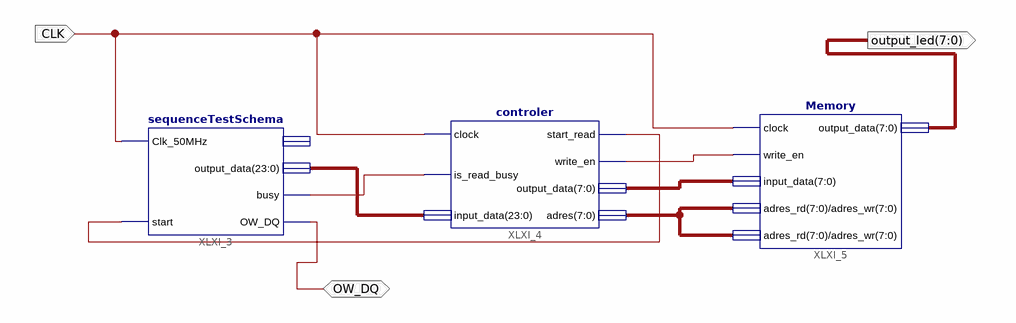
[diagram p0: schematic sheet 1]
// Xilinx ISE schematic seq_controler.sch (spartan3e) as structural Verilog: 3 symbols, 3 ports
module seq_controler (
  input  CLK,
  inout  OW_DQ,
  output [7:0] output_led
);

  wire clkout, XLXN_1, XLXN_7;
  wire [7:0] XLXN_11, XLXN_13;
  wire [23:0] XLXN_2;

  sequenceTestSchema XLXI_3 (
    .Clk_50MHz(CLK), .start(XLXN_7), .output_data(XLXN_2), .busy(XLXN_1), .OW_DQ(OW_DQ));  // open: test_out
  controler XLXI_4 (
    .clock(CLK), .is_read_busy(XLXN_1), .input_data(XLXN_2), .start_read(XLXN_7), .write_en(clkout),
    .output_data(XLXN_11), .adres(XLXN_13));
  Memory XLXI_5 (
    .clock(CLK), .write_en(clkout), .input_data(XLXN_11), .adres_rd(XLXN_13), .adres_wr(XLXN_13),
    .output_data(output_led));
endmodule
